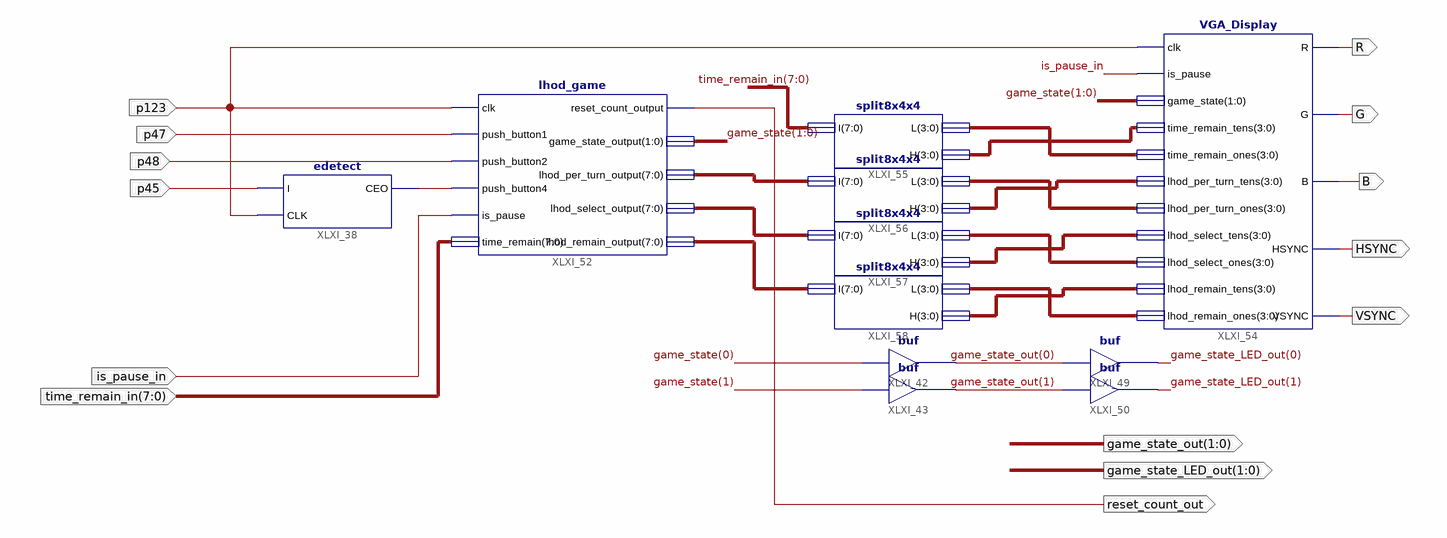
[diagram p0: schematic sheet 1]
// Xilinx ISE schematic fpga1.sch (spartan6) as structural Verilog: 11 symbols, 14 ports
module fpga1 (
  input  p45,
  input  p123,
  input  p47,
  input  p48,
  input  is_pause_in,
  input  [7:0] time_remain_in,
  output reset_count_out,
  output [1:0] game_state_out,
  output [1:0] game_state_LED_out,
  output R,
  output G,
  output B,
  output VSYNC,
  output HSYNC
);

  wire XLXN_233;
  wire [1:0] game_state;
  wire [3:0] XLXN_275, XLXN_276, XLXN_277, XLXN_278, XLXN_279, XLXN_280, XLXN_282, XLXN_283;
  wire [7:0] XLXN_288, XLXN_289, XLXN_290;

  edetect XLXI_38 (.CEO(XLXN_233), .CLK(p123), .I(p45));
  buf XLXI_42 (game_state_out[0], game_state[0]);
  buf XLXI_43 (game_state_out[1], game_state[1]);
  buf XLXI_49 (game_state_LED_out[0], game_state_out[0]);
  buf XLXI_50 (game_state_LED_out[1], game_state_out[1]);
  lhod_game XLXI_52 (
    .clk(p123), .push_button1(p47), .push_button2(p48), .push_button4(XLXN_233), .is_pause(is_pause_in),
    .time_remain(time_remain_in), .reset_count_output(reset_count_out), .game_state_output(game_state),
    .lhod_per_turn_output(XLXN_288), .lhod_select_output(XLXN_289), .lhod_remain_output(XLXN_290));
  VGA_Display XLXI_54 (
    .clk(p123), .is_pause(is_pause_in), .game_state(game_state), .time_remain_tens(XLXN_283),
    .time_remain_ones(XLXN_282), .lhod_per_turn_tens(XLXN_279), .lhod_per_turn_ones(XLXN_280),
    .lhod_select_tens(XLXN_277), .lhod_select_ones(XLXN_278), .lhod_remain_tens(XLXN_275),
    .lhod_remain_ones(XLXN_276), .R(R), .G(G), .B(B), .HSYNC(HSYNC), .VSYNC(VSYNC));
  split8x4x4 XLXI_55 (.H(XLXN_283), .I(time_remain_in), .L(XLXN_282));
  split8x4x4 XLXI_56 (.H(XLXN_279), .I(XLXN_288), .L(XLXN_280));
  split8x4x4 XLXI_57 (.H(XLXN_277), .I(XLXN_289), .L(XLXN_278));
  split8x4x4 XLXI_58 (.H(XLXN_275), .I(XLXN_290), .L(XLXN_276));
endmodule
